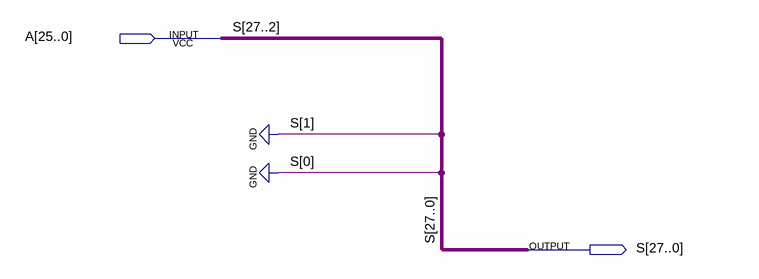
[diagram p0: schematic sheet]
// Quartus schematic Shift26BitsTo28Bits.bdf as structural Verilog: 0 symbols, 2 pins
module Shift26BitsTo28Bits (
  input  [25:0] A,
  output [27:0] S
);


  assign S = {A, 2'b00};
endmodule
